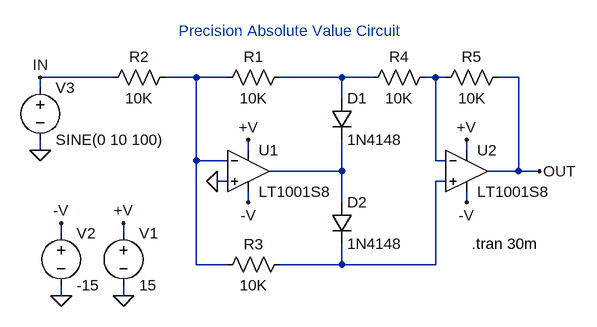
[diagram p0: schematic LT1001S8.asc]
LT1001S8.asc, the LTspice schematic file:
Version 4
SHEET 1 896 680
WIRE -16 96 -128 96
WIRE 112 96 64 96
WIRE 160 96 112 96
WIRE 336 96 240 96
WIRE 384 96 336 96
WIRE 480 96 464 96
WIRE 496 96 480 96
WIRE 608 96 576 96
WIRE -128 112 -128 96
WIRE 336 128 336 96
WIRE -128 208 -128 192
WIRE 192 208 192 192
WIRE 528 208 528 192
WIRE 112 224 112 96
WIRE 160 224 112 224
WIRE 480 224 480 96
WIRE 496 224 480 224
WIRE 336 240 336 192
WIRE 336 240 224 240
WIRE 608 240 608 96
WIRE 608 240 560 240
WIRE 640 240 608 240
WIRE 160 256 144 256
WIRE 496 256 480 256
WIRE 192 288 192 272
WIRE 336 288 336 240
WIRE 528 288 528 272
WIRE -96 336 -96 320
WIRE 0 336 0 320
WIRE 112 384 112 224
WIRE 160 384 112 384
WIRE 336 384 336 352
WIRE 336 384 240 384
WIRE 480 384 480 256
WIRE 480 384 336 384
WIRE -96 432 -96 416
WIRE 0 432 0 416
FLAG 0 432 0
FLAG 192 192 +V
FLAG 0 320 +V
FLAG 192 288 -V
FLAG -96 432 0
FLAG -96 320 -V
FLAG -128 208 0
FLAG 528 192 +V
FLAG 528 288 -V
FLAG 144 256 0
FLAG -128 96 IN
FLAG 640 240 OUT
SYMBOL voltage 0 320 R0
SYMATTR InstName V1
SYMATTR Value 15
SYMBOL voltage -96 320 R0
SYMATTR InstName V2
SYMATTR Value -15
SYMBOL res 256 80 R90
WINDOW 0 0 56 VBottom 2
WINDOW 3 32 56 VTop 2
SYMATTR InstName R1
SYMATTR Value 10K
SYMBOL voltage -128 96 R0
WINDOW 123 0 0 Left 2
WINDOW 39 0 0 Left 2
SYMATTR InstName V3
SYMATTR Value SINE(0 10 100)
SYMBOL diode 320 128 R0
SYMATTR InstName D1
SYMATTR Value 1N4148
SYMBOL res 80 80 R90
WINDOW 0 0 56 VBottom 2
WINDOW 3 32 56 VTop 2
SYMATTR InstName R2
SYMATTR Value 10K
SYMBOL res 256 368 R90
WINDOW 0 0 56 VBottom 2
WINDOW 3 32 56 VTop 2
SYMATTR InstName R3
SYMATTR Value 10K
SYMBOL res 480 80 R90
WINDOW 0 0 56 VBottom 2
WINDOW 3 32 56 VTop 2
SYMATTR InstName R4
SYMATTR Value 10K
SYMBOL res 592 80 R90
WINDOW 0 0 56 VBottom 2
WINDOW 3 32 56 VTop 2
SYMATTR InstName R5
SYMATTR Value 10K
SYMBOL diode 320 288 R0
SYMATTR InstName D2
SYMATTR Value 1N4148
SYMBOL opamps\\LT1001S8 192 176 R0
SYMATTR InstName U1
SYMBOL opamps\\LT1001S8 528 176 R0
SYMATTR InstName U2
TEXT 536 352 Left 2 !.tran 30m
TEXT 256 40 Bottom 2 ;Precision Absolute Value Circuit

The netlist it stands for:
* LT1001S8.asc
V1 +V 0 15
V2 -V 0 -15
R1 N002 N001 10K
V3 IN 0 SINE(0 10 100)
D1 N002 N004 1N4148
R2 N001 IN 10K
R3 N005 N001 10K
R4 N003 N002 10K
R5 OUT N003 10K
D2 N004 N005 1N4148
XU1 0 N001 +V -V N004 LT1001S8  ; pins In+ In- V+ V- OUT
XU2 N005 N003 +V -V OUT LT1001S8  ; pins In+ In- V+ V- OUT
.model D D
.lib standard.dio
.tran 30m
* Precision Absolute Value Circuit
.backanno
.end